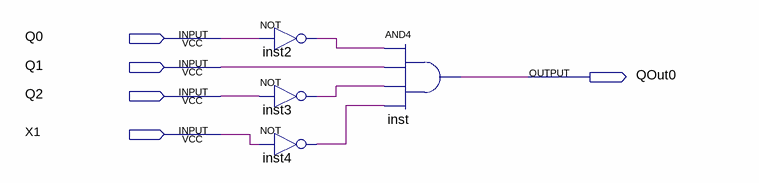
[diagram p0: schematic sheet]
// Quartus schematic M_q0.bdf as structural Verilog: 4 symbols, 5 pins
module M_q0 (
  input  Q0,
  input  Q1,
  input  Q2,
  input  X1,
  output QOut0
);

  wire inst2_out, inst3_out, inst4_out;

  not inst2 (inst2_out, Q0);
  not inst3 (inst3_out, Q2);
  not inst4 (inst4_out, X1);
  and inst (QOut0, inst2_out, Q1, inst3_out, inst4_out);
endmodule
